# Altium schematic sheet imu.SchDoc: IMU (Inertial Unit)
size A4; SheetNumber: 15; SheetTotal: 16
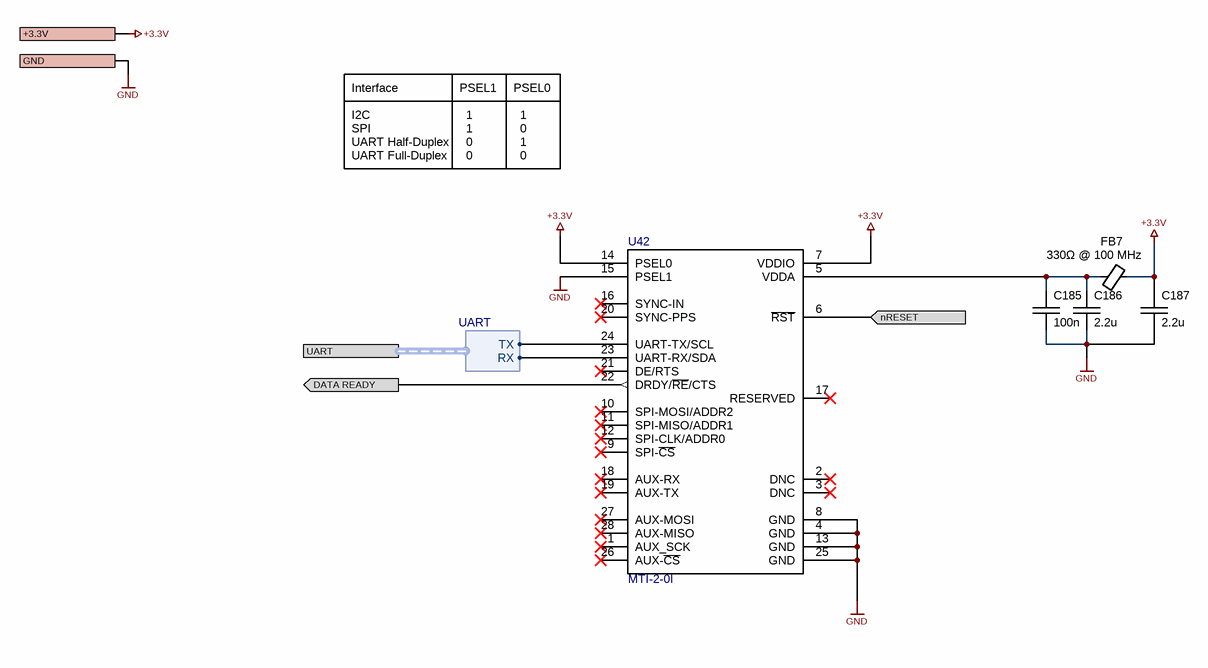
[diagram p0: imu.SchDoc]

## Parts
C185  value 100n  [SM/C0402]  (hidden comment: CL05A104KP5NNNC)
C186  value 2.2u  [SM/C0402]  (hidden comment: CL05A225MQ5NNNC)
C187  value 2.2u  [SM/C0402]  (hidden comment: CL05A225MQ5NNNC)
FB7  value 330Ω @ 100 MHz  [SM/L0603]  (hidden comment: BLM18KG331SN1D)
U42  MTI-2-0I  [MTi-1_PLCC_28P]

## Ports
+3.3V, DATA READY (out), GND, nRESET (in), UART (harness UART)

## Harnesses
UART: TX, RX

## Nets
+3.3V: C187.1 FB7.2 U42.7(VDDIO) U42.14(PSEL0) ; port +3.3V
GND: C185.2 C186.2 C187.2 U42.4(GND) U42.8(GND) U42.13(GND) U42.15(PSEL1) U42.25(GND) ; port GND
DATA READY: U42.22(DRDY/~{RE}/CTS) ; port DATA READY
nRESET: U42.6(~{RST}) ; port nRESET
NetC185_1: C185.1 C186.1 FB7.1 U42.5(VDDA)
NetU42_23: U42.23(UART-RX/SDA) ; port UART.RX
NetU42_24: U42.24(UART-TX/SCL) ; port UART.TX

Not connected (* = marked no-connect by the designer): U42 1(AUX_SCK)* 2(DNC)* 3(DNC)* 9(SPI-~{CS})* 10(SPI-MOSI/ADDR2)* 11(SPI-MISO/ADDR1)* 12(SPI-CLK/ADDR0)* 16(SYNC-IN)* 17(RESERVED)* 18(AUX-RX)* 19(AUX-TX)* 20(SYNC-PPS)* 21(DE/RTS)* 26(AUX-~{CS})* 27(AUX-MOSI)* 28(AUX-MISO)*

## Notes on the sheet
- I2C
- SPI
- Interface
- PSEL1
- 1
- PSEL0
- 0
- UART Half-Duplex
- UART Full-Duplex
- HES-SO / HEIG-VD / TIN / IAI
  Route de Cheseaux, 1
  CH-1401 Yverdon-les-Bains
  +41 24 557 73 77
  http://iai.heig-vd.ch
  iai@heig-vd.ch
- Title
- Format
- Date
- A4
- Project Name
- Author
- Project ID
- VCS
- Revision
- Page
- /
- File

## Library data of the parts
C185 = C: Chip Capacitor; Voltage: 16V; Dielectric: X7R; Supplier 1: Digi-Key; Supplier Part Number 1: 1276-1022-1-ND
C186 C187 = C: CAP CER 10UF 10V X5R 0805; Voltage: 6.3V; Supplier 1: Digi-Key; Supplier Part Number 1: 1276-1469-1-ND
FB7 = FB0603: FERRITE BEAD 330 OHM 0603 1LN / 330 Ohms @ 100 MHz 1 Power Line Ferrite Bead 0603 (1608 Metric) 1.7A 80mOhm; Supplier 1: Digi-Key; Supplier Part Number 1: 490-5256-1-ND
U42 = XSENS MTI-x: Accelerometer, Gyroscope, Magnetometer, 9 Axis Sensor I²C, SPI, UART Output / 1551-MTI-2-0I-ND; Supplier 1: Digi-Key; Supplier Part Number 1: 1551-MTI-2-0I-ND